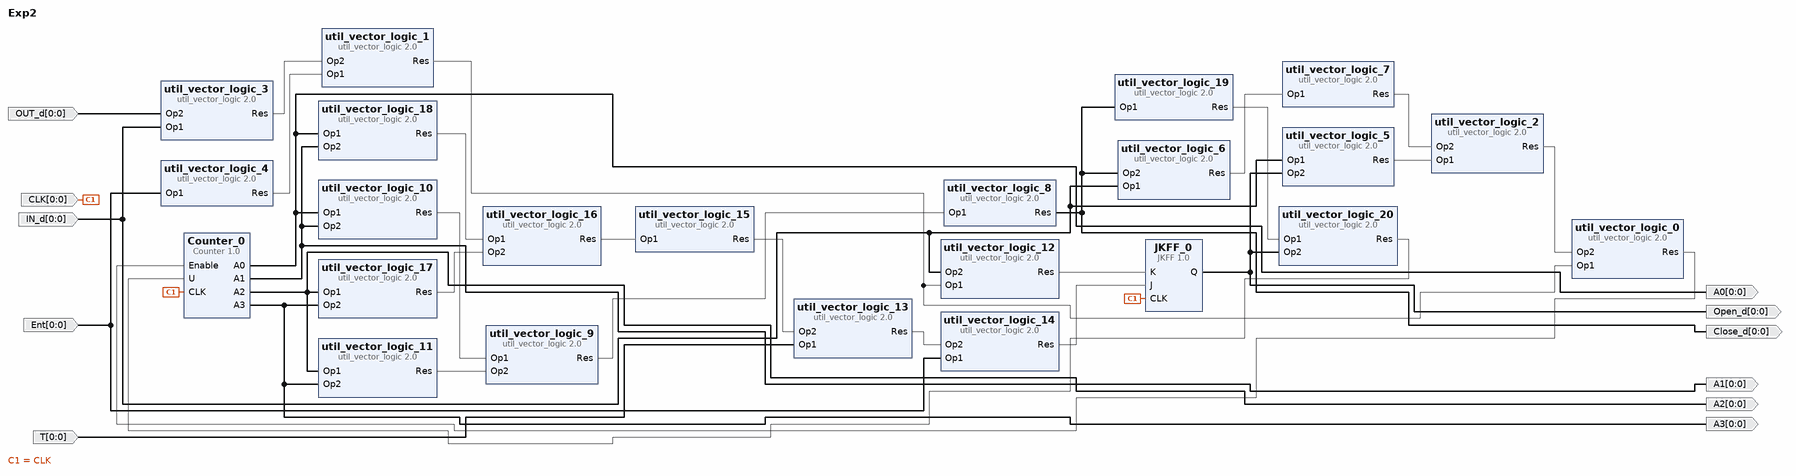
[diagram p0: block diagram of the top level]
# Vivado block design Exp2, xc7vx485tffg1157-1, Vivado 2019.1
create_bd_design Exp2

create_bd_port -dir O -from 0 -to 0 Open_d
create_bd_port -dir O -from 0 -to 0 A0
create_bd_port -dir O -from 0 -to 0 A1
create_bd_port -dir O -from 0 -to 0 A2
create_bd_port -dir O -from 0 -to 0 A3
create_bd_port -dir I -from 0 -to 0 CLK
create_bd_port -dir I -from 0 -to 0 Ent
create_bd_port -dir I -from 0 -to 0 IN_d
create_bd_port -dir I -from 0 -to 0 OUT_d
create_bd_port -dir O -from 0 -to 0 Close_d
create_bd_port -dir I -from 0 -to 0 T

create_bd_cell -type ip -vlnv Group5:user:JKFF:1.0 JKFF_0
create_bd_cell -type ip -vlnv Group5:user:Counter:1.0 Counter_0
create_bd_cell -type ip -vlnv xilinx.com:ip:util_vector_logic:2.0 util_vector_logic_0
set_property -dict {CONFIG.C_SIZE 1} [get_bd_cells util_vector_logic_0]
create_bd_cell -type ip -vlnv xilinx.com:ip:util_vector_logic:2.0 util_vector_logic_1
set_property -dict {CONFIG.C_SIZE 1} [get_bd_cells util_vector_logic_1]
create_bd_cell -type ip -vlnv xilinx.com:ip:util_vector_logic:2.0 util_vector_logic_2
set_property -dict {CONFIG.C_OPERATION or CONFIG.C_SIZE 1} [get_bd_cells util_vector_logic_2]
create_bd_cell -type ip -vlnv xilinx.com:ip:util_vector_logic:2.0 util_vector_logic_3
set_property -dict {CONFIG.C_OPERATION xor CONFIG.C_SIZE 1} [get_bd_cells util_vector_logic_3]
create_bd_cell -type ip -vlnv xilinx.com:ip:util_vector_logic:2.0 util_vector_logic_4
set_property -dict {CONFIG.C_OPERATION not CONFIG.C_SIZE 1} [get_bd_cells util_vector_logic_4]
create_bd_cell -type ip -vlnv xilinx.com:ip:util_vector_logic:2.0 util_vector_logic_5
set_property -dict {CONFIG.C_SIZE 1} [get_bd_cells util_vector_logic_5]
create_bd_cell -type ip -vlnv xilinx.com:ip:util_vector_logic:2.0 util_vector_logic_6
set_property -dict {CONFIG.C_OPERATION or CONFIG.C_SIZE 1} [get_bd_cells util_vector_logic_6]
create_bd_cell -type ip -vlnv xilinx.com:ip:util_vector_logic:2.0 util_vector_logic_7
set_property -dict {CONFIG.C_OPERATION not CONFIG.C_SIZE 1} [get_bd_cells util_vector_logic_7]
create_bd_cell -type ip -vlnv xilinx.com:ip:util_vector_logic:2.0 util_vector_logic_8
set_property -dict {CONFIG.C_OPERATION not CONFIG.C_SIZE 1} [get_bd_cells util_vector_logic_8]
create_bd_cell -type ip -vlnv xilinx.com:ip:util_vector_logic:2.0 util_vector_logic_9
set_property -dict {CONFIG.C_OPERATION or CONFIG.C_SIZE 1} [get_bd_cells util_vector_logic_9]
create_bd_cell -type ip -vlnv xilinx.com:ip:util_vector_logic:2.0 util_vector_logic_10
set_property -dict {CONFIG.C_OPERATION or CONFIG.C_SIZE 1} [get_bd_cells util_vector_logic_10]
create_bd_cell -type ip -vlnv xilinx.com:ip:util_vector_logic:2.0 util_vector_logic_11
set_property -dict {CONFIG.C_OPERATION or CONFIG.C_SIZE 1} [get_bd_cells util_vector_logic_11]
create_bd_cell -type ip -vlnv xilinx.com:ip:util_vector_logic:2.0 util_vector_logic_12
set_property -dict {CONFIG.C_SIZE 1} [get_bd_cells util_vector_logic_12]
create_bd_cell -type ip -vlnv xilinx.com:ip:util_vector_logic:2.0 util_vector_logic_13
set_property -dict {CONFIG.C_SIZE 1} [get_bd_cells util_vector_logic_13]
create_bd_cell -type ip -vlnv xilinx.com:ip:util_vector_logic:2.0 util_vector_logic_14
set_property -dict {CONFIG.C_SIZE 1} [get_bd_cells util_vector_logic_14]
create_bd_cell -type ip -vlnv xilinx.com:ip:util_vector_logic:2.0 util_vector_logic_15
set_property -dict {CONFIG.C_OPERATION not CONFIG.C_SIZE 1} [get_bd_cells util_vector_logic_15]
create_bd_cell -type ip -vlnv xilinx.com:ip:util_vector_logic:2.0 util_vector_logic_16
set_property -dict {CONFIG.C_SIZE 1} [get_bd_cells util_vector_logic_16]
create_bd_cell -type ip -vlnv xilinx.com:ip:util_vector_logic:2.0 util_vector_logic_17
set_property -dict {CONFIG.C_SIZE 1} [get_bd_cells util_vector_logic_17]
create_bd_cell -type ip -vlnv xilinx.com:ip:util_vector_logic:2.0 util_vector_logic_18
set_property -dict {CONFIG.C_SIZE 1} [get_bd_cells util_vector_logic_18]
create_bd_cell -type ip -vlnv xilinx.com:ip:util_vector_logic:2.0 util_vector_logic_19
set_property -dict {CONFIG.C_OPERATION not CONFIG.C_SIZE 1} [get_bd_cells util_vector_logic_19]
create_bd_cell -type ip -vlnv xilinx.com:ip:util_vector_logic:2.0 util_vector_logic_20
set_property -dict {CONFIG.C_SIZE 1} [get_bd_cells util_vector_logic_20]

# ---- connections ----

connect_bd_net [get_bd_pins JKFF_0/Q] [get_bd_ports Open_d] [get_bd_pins util_vector_logic_5/Op2] [get_bd_pins util_vector_logic_20/Op2]
connect_bd_net [get_bd_pins Counter_0/A0] [get_bd_ports A0] [get_bd_pins util_vector_logic_10/Op1] [get_bd_pins util_vector_logic_18/Op1]
connect_bd_net [get_bd_pins Counter_0/A1] [get_bd_ports A1] [get_bd_pins util_vector_logic_10/Op2] [get_bd_pins util_vector_logic_18/Op2]
connect_bd_net [get_bd_pins Counter_0/A2] [get_bd_ports A2] [get_bd_pins util_vector_logic_11/Op1] [get_bd_pins util_vector_logic_17/Op1]
connect_bd_net [get_bd_pins Counter_0/A3] [get_bd_ports A3] [get_bd_pins util_vector_logic_11/Op2] [get_bd_pins util_vector_logic_17/Op2]
connect_bd_net [get_bd_ports CLK] [get_bd_pins JKFF_0/CLK] [get_bd_pins Counter_0/CLK]
connect_bd_net [get_bd_pins util_vector_logic_0/Res] [get_bd_pins Counter_0/Enable]
connect_bd_net [get_bd_pins util_vector_logic_1/Res] [get_bd_pins util_vector_logic_0/Op1] [get_bd_pins util_vector_logic_12/Op1]
connect_bd_net [get_bd_pins util_vector_logic_2/Res] [get_bd_pins util_vector_logic_0/Op2]
connect_bd_net [get_bd_pins util_vector_logic_4/Res] [get_bd_pins util_vector_logic_1/Op1]
connect_bd_net [get_bd_pins util_vector_logic_3/Res] [get_bd_pins util_vector_logic_1/Op2]
connect_bd_net [get_bd_ports Ent] [get_bd_pins util_vector_logic_4/Op1] [get_bd_pins util_vector_logic_14/Op1]
connect_bd_net [get_bd_ports IN_d] \
  [get_bd_pins util_vector_logic_3/Op1] [get_bd_pins util_vector_logic_6/Op1] [get_bd_pins util_vector_logic_5/Op1] \
  [get_bd_pins util_vector_logic_12/Op2]
connect_bd_net [get_bd_ports OUT_d] [get_bd_pins util_vector_logic_3/Op2]
connect_bd_net [get_bd_pins util_vector_logic_5/Res] [get_bd_pins util_vector_logic_2/Op1]
connect_bd_net [get_bd_pins util_vector_logic_6/Res] [get_bd_pins util_vector_logic_7/Op1]
connect_bd_net [get_bd_pins util_vector_logic_7/Res] [get_bd_pins util_vector_logic_2/Op2]
connect_bd_net [get_bd_pins util_vector_logic_8/Res] \
  [get_bd_ports Close_d] [get_bd_pins util_vector_logic_6/Op2] [get_bd_pins util_vector_logic_19/Op1]
connect_bd_net [get_bd_pins util_vector_logic_10/Res] [get_bd_pins util_vector_logic_9/Op1]
connect_bd_net [get_bd_pins util_vector_logic_11/Res] [get_bd_pins util_vector_logic_9/Op2]
connect_bd_net [get_bd_pins util_vector_logic_9/Res] [get_bd_pins util_vector_logic_8/Op1]
connect_bd_net [get_bd_pins util_vector_logic_12/Res] [get_bd_pins JKFF_0/K]
connect_bd_net [get_bd_pins util_vector_logic_13/Res] [get_bd_pins util_vector_logic_14/Op2]
connect_bd_net [get_bd_pins util_vector_logic_14/Res] [get_bd_pins JKFF_0/J]
connect_bd_net [get_bd_ports T] [get_bd_pins util_vector_logic_13/Op1]
connect_bd_net [get_bd_pins util_vector_logic_15/Res] [get_bd_pins util_vector_logic_13/Op2]
connect_bd_net [get_bd_pins util_vector_logic_16/Res] [get_bd_pins util_vector_logic_15/Op1]
connect_bd_net [get_bd_pins util_vector_logic_18/Res] [get_bd_pins util_vector_logic_16/Op1]
connect_bd_net [get_bd_pins util_vector_logic_17/Res] [get_bd_pins util_vector_logic_16/Op2]
connect_bd_net [get_bd_pins util_vector_logic_19/Res] [get_bd_pins util_vector_logic_20/Op1]
connect_bd_net [get_bd_pins util_vector_logic_20/Res] [get_bd_pins Counter_0/U]

validate_bd_design
save_bd_design
